# EAGLE design 2014-11-21_2.2_lcd_13 (EAGLE 7.1.0)
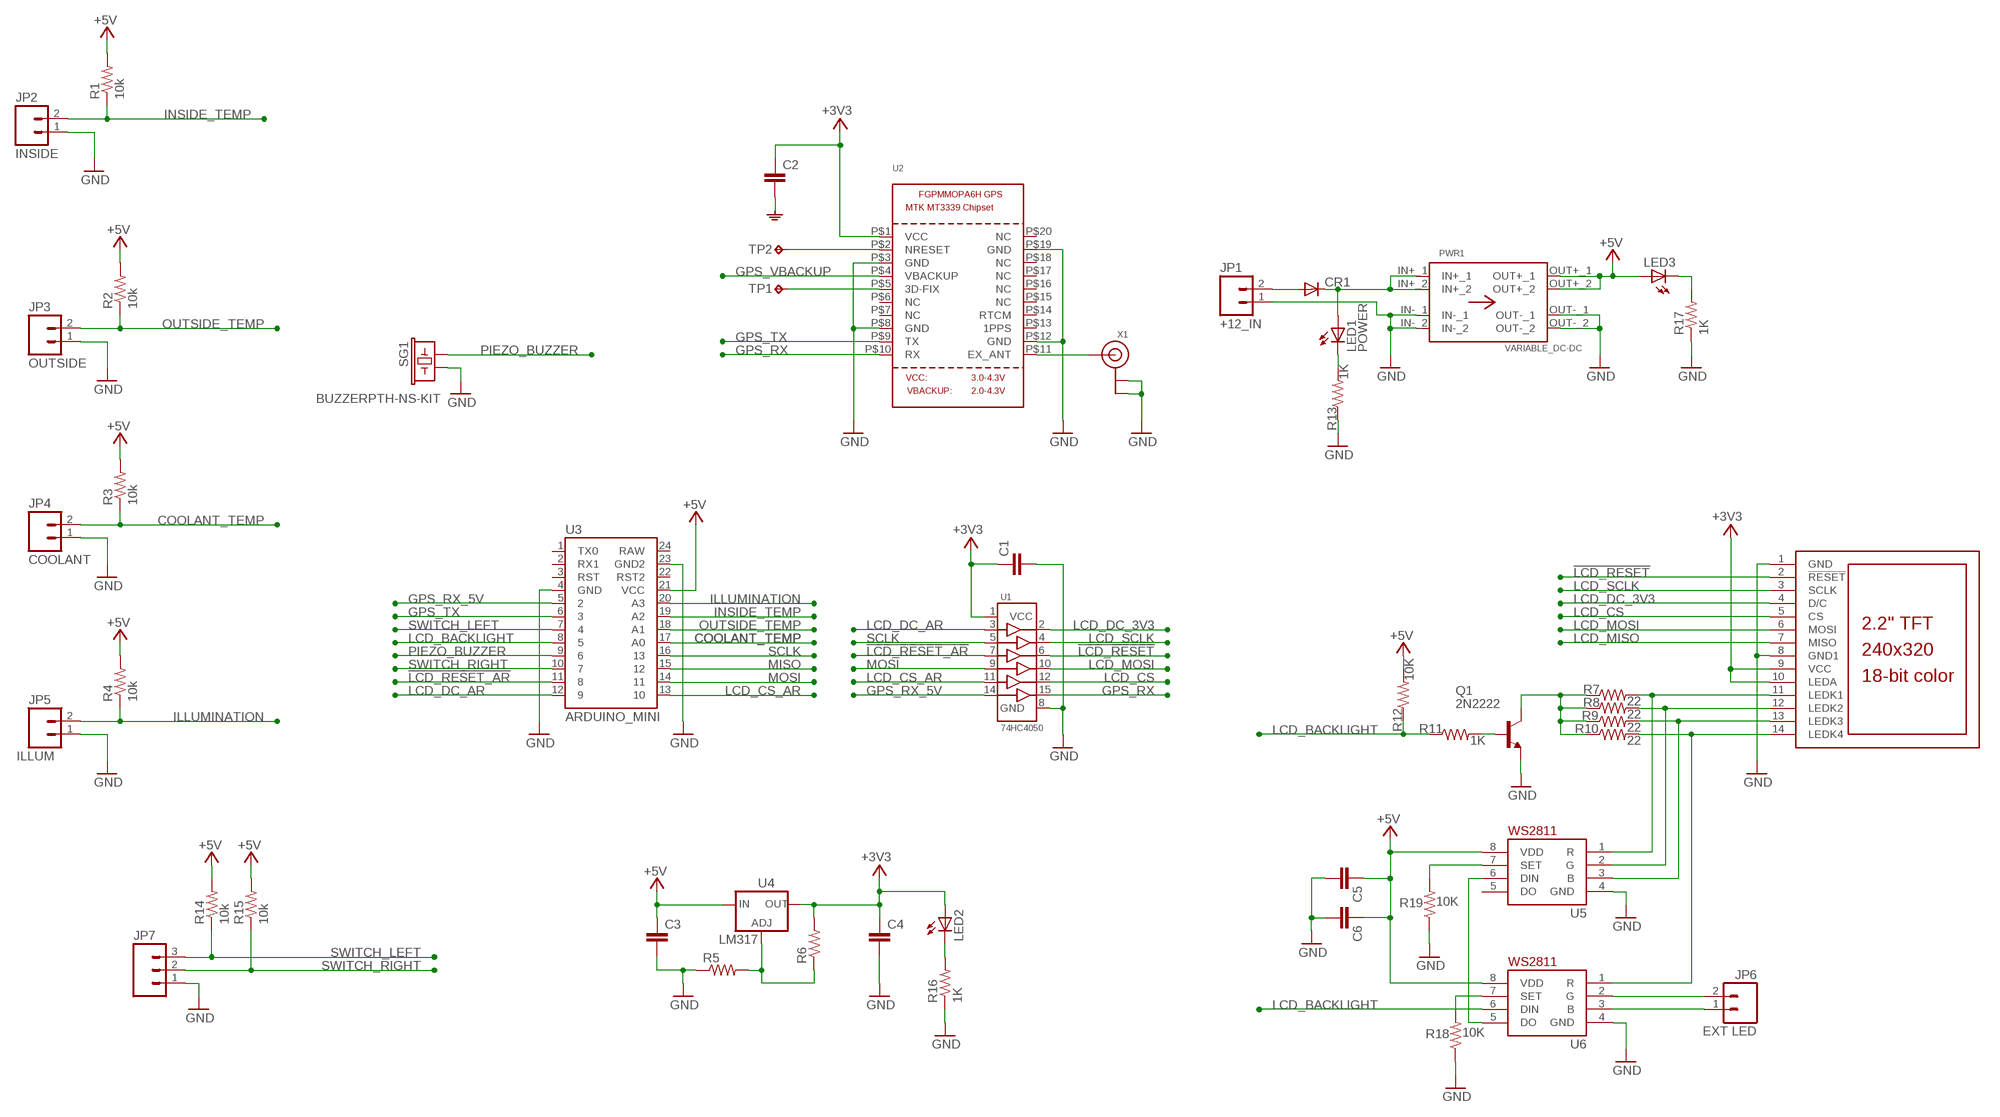
[diagram p0: schematic, sheet 1]

## Parts
C1  CAP0805  [0805]
C2  CAP0805  [0805]
C3  CAP0805  [0805]
C4  CAP0805  [0805]
C5  CAP0603-CAP  [0603-CAP]
C6  CAP0603-CAP  [0603-CAP]
CR1  DIODESMA-ALT  [SMA-DIODE_ALT]
JP1  +12_IN  M02JST-PTH-VERT  [JST-2-PTH-VERT]
JP2  INSIDE  M02JST-PTH-VERT  [JST-2-PTH-VERT]
JP3  OUTSIDE  M02JST-PTH-VERT  [JST-2-PTH-VERT]
JP4  COOLANT  M02JST-PTH-VERT  [JST-2-PTH-VERT]
JP5  ILLUM  M02JST-PTH-VERT  [JST-2-PTH-VERT]
JP6  EXT LED  M02JST-PTH-VERT  [JST-2-PTH-VERT]
JP7  M03POLAR  [MOLEX-1X3]
LED1  POWER  LED3MM  [LED3MM]
LED2  LED0603  [LED-0603]
LED3  LED0603  [LED-0603]
PWR1  VARIABLE_DC-DC  [VARIABLE_DC-DC]
Q1  2N2222  [TO92]
R1  10k  RESISTOR0805-RES  [0805]
R2  10k  RESISTOR0805-RES  [0805]
R3  10k  RESISTOR0805-RES  [0805]
R4  10k  RESISTOR0805-RES  [0805]
R5  RESISTOR0805-RES  [0805]
R6  RESISTOR0805-RES  [0805]
R7  22  RESISTOR0805-RES  [0805]
R8  22  RESISTOR0805-RES  [0805]
R9  22  RESISTOR0805-RES  [0805]
R10  22  RESISTOR0805-RES  [0805]
R11  1K  RESISTOR0805-RES  [0805]
R12  10K  RESISTOR0805-RES  [0805]
R13  1K  RESISTOR0805-RES  [0805]
R14  10k  RESISTOR0805-RES  [0805]
R15  10k  RESISTOR0805-RES  [0805]
R16  1K  RESISTOR0805-RES  [0805]
R17  1K  RESISTOR0805-RES  [0805]
R18  10K  RESISTOR0805-RES  [0805]
R19  10K  RESISTOR0805-RES  [0805]
SG1  BUZZERPTH-NS-KIT  [BUZZER-12MM-NS-KIT]
TP1  TPPAD1-13  [P1-13]
TP2  TPPAD1-13  [P1-13]
U1  74HC4050  [SO16]
U2  GPS_FGPMMOPA6H  [FGPMMOPA6H]
U3  ARDUINO_MINI  [ARDUINO_MINI]
U4  LM317  V_REG_317SMD  [SOT223]
U5  WS2811-SOP8  [SO08-SKINNYPADS]
U6  WS2811-SOP8  [SO08-SKINNYPADS]
U$1  2.2_LCD  [2.2_LCD]
X1  ANTENNA_U.FL  [U.FL]

## Nets
!LCD_RESET: U1.6 U$1.2(!RESET)
!LCD_RESET_AR: U1.7 U3.11
+3V3: C1.1 C2.1 C4.1 LED2.A R6.2 U1.1(VCC) U2.P$1(VCC) U4.2(OUT) U$1.9(VCC) U$1.10(LEDA)
+5V: C3.1 C5.1 C6.1 LED3.A PWR1.OUT+_1 PWR1.OUT+_2 R1.2 R2.2 R3.2 R4.2 R12.2 R14.2 R15.2 U3.21(VCC) U4.3(IN) U5.8(VDD) U6.8(VDD)
COOLANT_TEMP: JP4.2 R3.1 U3.17(A0)
GND: C1.2 C3.2 C4.2 C5.2 C6.2 JP1.1 JP2.1 JP3.1 JP4.1 JP5.1 JP7.1 PWR1.IN-_1 PWR1.IN-_2 PWR1.OUT-_1 PWR1.OUT-_2 Q1.1(E) R5.1 R13.1 R16.1 R17.1 R18.1 R19.1 SG1.- U1.8(GND) U2.P$3(GND) U2.P$8(GND) U2.P$12(GND) U2.P$19(GND) U3.4(GND) U3.23(GND2) U5.4(GND) U6.4(GND) U$1.1(GND) U$1.8(GND1) X1.1(GND) X1.2(GND)
GPS_RX: U1.15 U2.P$10(RX)
GPS_RX_5V: U1.14 U3.5
GPS_TX: U2.P$9(TX) U3.6
GPS_VBACKUP: U2.P$4(VBACKUP)
ILLUMINATION: JP5.2 R4.1 U3.20(A3)
INSIDE_TEMP: JP2.2 R1.1 U3.19(A2)
LCD_BACKLIGHT: R11.1 R12.1 U3.8 U6.6(DIN)
LCD_CS: U1.12 U$1.5(CS)
LCD_CS_AR: U1.11 U3.13
LCD_DC_3V3: U1.2 U$1.4(D/C)
LCD_DC_AR: U1.3 U3.12
LCD_MISO: U$1.7(MISO)
LCD_MOSI: U1.10 U$1.6(MOSI)
LCD_SCLK: U1.4 U$1.3(SCLK)
MISO: U3.15
MOSI: U1.9 U3.14
N$1: TP2.TP U2.P$2(NRESET)
N$2: U2.P$11(EX_ANT) X1.3(SIGNAL)
N$3: R7.2 U5.1(R) U$1.11(LEDK1)
N$4: R8.2 U5.2(G) U$1.12(LEDK2)
N$5: R9.2 U5.3(B) U$1.13(LEDK3)
N$6: R5.2 R6.1 U4.1(ADJ)
N$7: R10.2 U6.1(R) U$1.14(LEDK4)
N$8: Q1.3(C) R7.1 R8.1 R9.1 R10.1
N$9: Q1.2(B) R11.2
N$10: CR1.A JP1.2
N$11: CR1.C LED1.A PWR1.IN+_1 PWR1.IN+_2
N$13: JP6.2 U6.2(G)
N$17: LED1.K(C) R13.2
N$18: TP1.TP U2.P$5(3D-FIX)
N$19: LED2.C R16.2
N$20: LED3.C R17.2
N$21: U5.6(DIN) U6.5(DO)
N$22: R18.2 U6.7(SET)
N$23: JP6.1 U6.3(B)
N$24: R19.2 U5.7(SET)
OUTSIDE_TEMP: JP3.2 R2.1 U3.18(A1)
P$1: C2.2 ; supply symbol labelled GND
PIEZO_BUZZER: SG1.+ U3.9
SCLK: U1.5 U3.16
SWITCH_LEFT: JP7.3 R14.1 U3.7
SWITCH_RIGHT: JP7.2 R15.1 U3.10
Unconnected: U2.P$6(NC) U2.P$7(NC) U2.P$13(1PPS) U2.P$14(RTCM) U2.P$15(NC) U2.P$16(NC) U2.P$17(NC) U2.P$18(NC) U2.P$20(NC) U3.1(TX0) U3.2(RX1) U3.3(RST) U3.22(RST2) U3.24(RAW) U5.5(DO)

## Library data of the parts
C1-C6 = SparkFun-Passives:CAP: Capacitor Standard 0603 ceramic capacitor, and 0.1" leaded capacitor.
CR1 = SparkFun-DiscreteSemi:DIODE: Diode These are standard reverse protection diodes and small signal diodes. SMA package can handle up to about 1A. SOD-323 can handle about 200mA. What the SOD-323 package when ordering, there are some mfgs out there that are 5-pin packages.
JP1-JP6 = SparkFun-Connectors:M02: Standard 2-pin 0.1" header. Use with - straight break away headers ( PRT-00116) - right angle break away headers (PRT-00553) - swiss pins (PRT-00743) - machine pins (PRT-00117) - female headers (PRT-00115) Molex polarized connector foot print use with: PRT-08233 with associated crimp pins and housings. 2.54_SCREWTERM for use with PRT-10571. 3.5mm Screw Terminal footprints for PRT-08084 5mm Screw Terminal footprints for use with PRT-08432
JP7 = SparkFun-Connectors:M03: Header 3 Standard 3-pin 0.1" header. Use with straight break away headers (SKU : PRT-00116), right angle break away headers (PRT-00553), swiss pins (PRT-00743), machine pins (PRT-00117), and female headers (PRT-00115). Molex polarized connector foot print use with SKU : PRT-08232 with associated crimp pins and housings.
LED1-LED3 = SparkFun-LED:LED: LEDs Standard schematic elements and footprints for 5mm, 3mm, 1206, and 0603 sized LEDs. 5mm - Spark Fun Electronics SKU : COM-00529 (and others)
PWR1 = !EXTRON:VARIABLE_DC-DC
Q1 = adafruit:2N2222: NPN TRANSISTOR Big oval pads
R1-R19 = SparkFun-Passives:RESISTOR: Resistor Basic schematic elements and footprints for 0603, 1206, and PTH resistors.
SG1 = SparkFun-Electromechanical:BUZZER: Buzzer 12mm Spark Fun Electronics SKU : Comp-Buzzer
TP1 TP2 = testpad:TP: Test pad
U1 = !EXTRON:74HC4050
U2 = adafruit:GPS_FGPMMOPA6H: GPS Module - MTK MT3339 Chipset, -165dBm sensitivity, 22 channels, 10Hz, auto-select external antenna options
U3 = SparkFun-Boards:ARDUINO_MINI: Arduino Pro Mini footprint
U4 = SparkFun-PowerIC:V_REG_317: Voltage Regulator Standard LM317 adjustable voltage regulator. AOI (Adjust Output Input). Google 'LM317 Calculator' for easy to use app to get the two resistor values needed. 240/720 for 5V output. 240/390 for 3.3V output. Spark Fun Electronics SKU : COM-00527
U5 U6 = adafruit:WS2811
U$1 = !EXTRON:2.2_LCD
X1 = adafruit:ANTENNA_U.FL: U.FL Antenna Connector

## Board
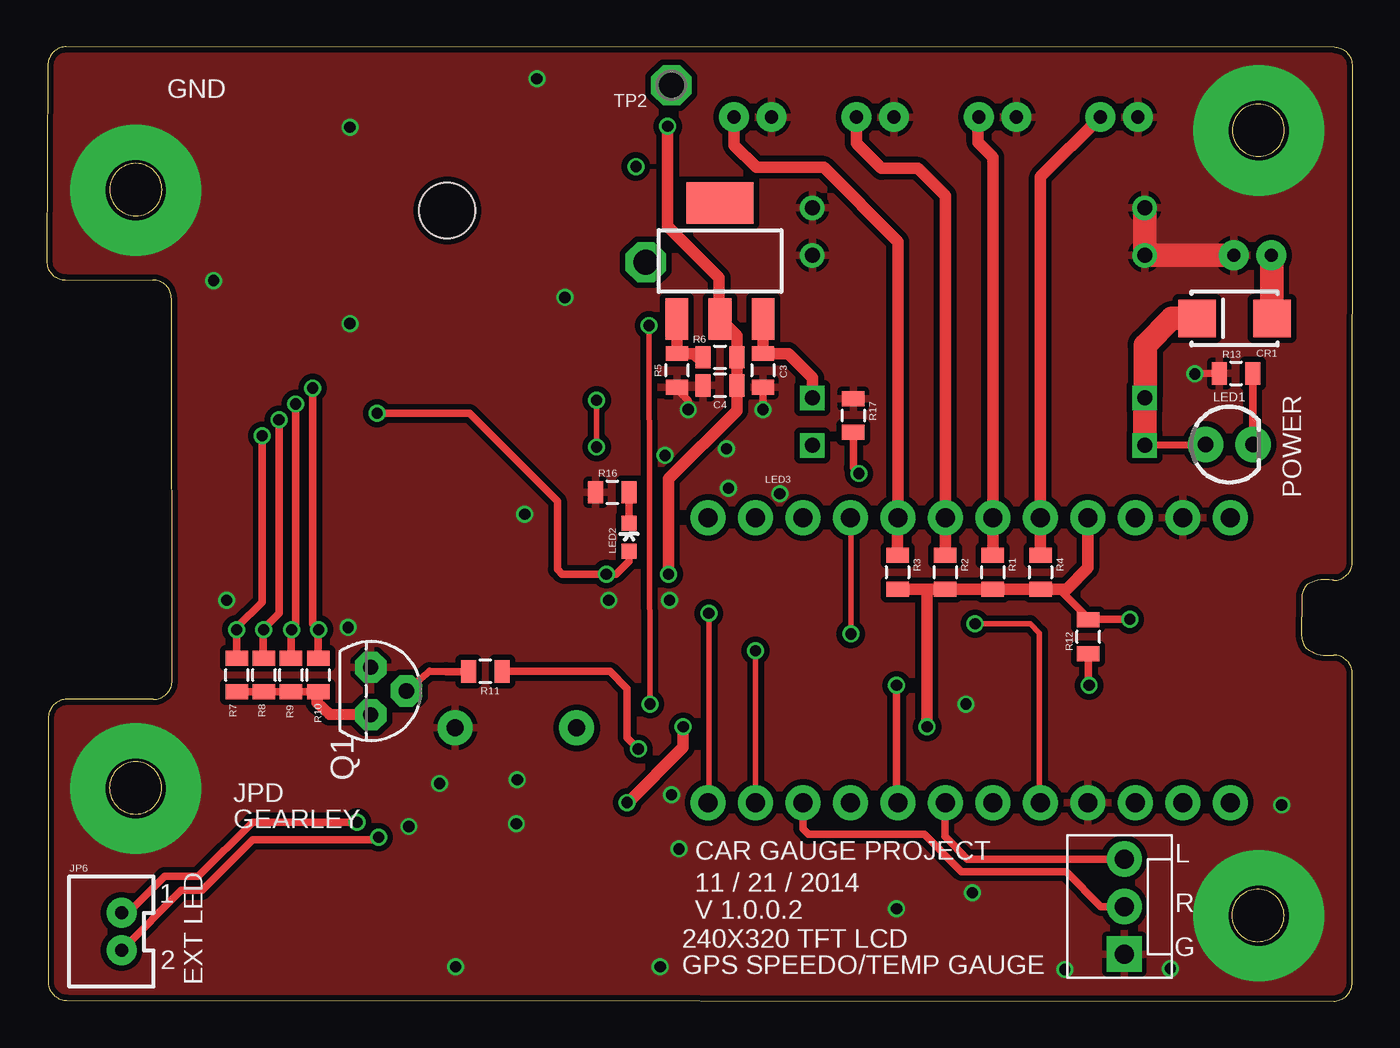
[diagram p1: board, top side]
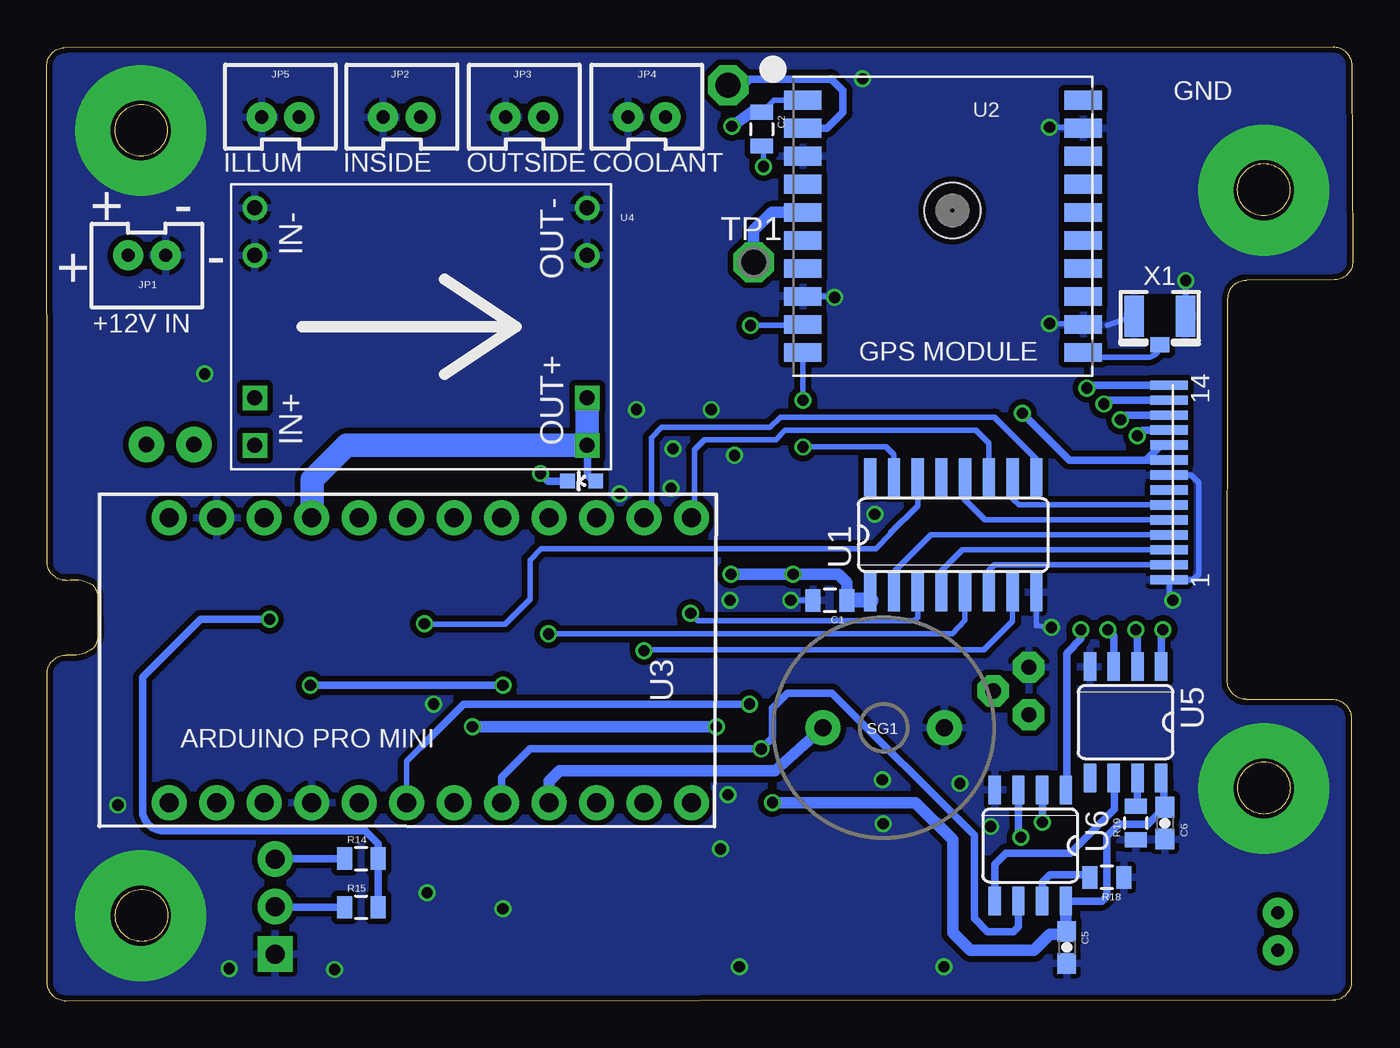
[diagram p2: board, bottom side, seen from below]

Size 69.89 x 51.05 mm. Coordinates in mm from the lower left corner, seen from the top.
Outline: 0.08,15.14 0.08,1.04 arc45 0.37,0.33 arc45 1.08,0.04 68.86,0 arc45 69.56,0.29 arc45 69.86,1 69.87,17.5 arc45 69.57,18.21 arc45 68.87,18.51 68.79,18.51 arc-45 67.44,18.85 arc-45 67.14,19.56 67.14,21.56 arc-45 67.44,22.26 arc-45 68.79,22.51 68.87,22.51 arc45 69.58,22.8 arc45 69.87,23.5 69.89,50.01 arc45 69.59,50.72 arc45 68.89,51.01 1.06,51.05 arc45 0.35,50.76 arc45 0.06,50.05 0,39.57 arc45 0.29,38.87 arc45 1,38.57 5.67,38.57 arc-45 6.38,38.28 arc-45 6.67,37.57 6.71,17.14 arc-45 6.42,16.43 arc-45 5.71,16.14 1.08,16.14 arc45 0.38,15.85 arc45 0.08,15.14
Outline: 6.17,43.41 arc180 3.37,43.41 arc180 6.17,43.41
Outline: 6.15,11.41 arc180 3.35,11.41 arc180 6.15,11.41
Outline: 66.21,4.58 arc180 63.41,4.58 arc180 66.21,4.58
Outline: 66.23,46.58 arc180 63.43,46.58 arc180 66.23,46.58
Copper layers (1*16): Top 0.035mm / dielectric 1.5mm / Bottom 0.035mm
Design rules "dirt_cheap_dirty_boards.v1": minimum track width 5mil, minimum drill 12mil, track to track 5mil, track to pad 5mil, pad to pad 5mil, via to via 5mil, smd to smd 0mil, copper to edge 10mil, drill to drill 10mil, minimum pad ring 10mil, minimum via ring 6mil, stop-mask expansion 2mil, vias tented up to drill 25mil, thermal gap 10mil

### Footprints (pad centres in the part's own frame; a part is rotated, then mirrored left to right if it is on the bottom)
0805 = smd 0.8 x 1.2: 1 -0.9,0; 2 0.9,0
0603-CAP = smd 1.1 x 1: 1 -0.85,0; 2 0.85,0
SMA-DIODE_ALT = smd 2 x 2: A -2,0; C 2,0
JST-2-PTH-VERT = drill 0.7 pad 1.6: 1 -1,-0.55; 2 1,-0.55
MOLEX-1X3 = drill 1.016 pad 1.88 square: 1 0,0 | drill 1.016 pad 1.88: 2 2.54,0; 3 5.08,0
LED3MM = drill 0.813 pad 1.88: A -1.27,0; K 1.27,0
LED-0603 = smd 0.8 x 0.8: A 0,-0.75; C 0,0.75
VARIABLE_DC-DC = drill 0.8 square: IN+_1 -10.16,7.62; IN+_2 -7.62,7.62; OUT+_1 -10.16,-10.16; OUT+_2 -7.62,-10.16 | drill 0.8: IN-_1 0,7.62; IN-_2 2.54,7.62; OUT-_1 0,-10.16; OUT-_2 2.54,-10.16
TO92 = drill 0.813 pad 1.676 octagon: 1 -1.27,0; 2 0,1.905; 3 1.27,0
BUZZER-12MM-NS-KIT = drill 0.9 pad 1.88: + 3.25,0; - -3.25,0
P1-13 = drill 1.321 pad 2.159 octagon: TP 0,0
SO16 = smd 0.66 x 2.032: 1 -4.445,-3.073; 2 -3.175,-3.073; 3 -1.905,-3.073; 4 -0.635,-3.073; 5 0.635,-3.073; 6 1.905,-3.073; 7 3.175,-3.073; 8 4.445,-3.073; 9 4.445,3.073; 10 3.175,3.073; 11 1.905,3.073; 12 0.635,3.073; 13 -0.635,3.073; 14 -1.905,3.073; 15 -3.175,3.073; 16 -4.445,3.073
FGPMMOPA6H = smd 2 x 1: P$1 -7.5,6.75; P$2 -7.5,5.25; P$3 -7.5,3.75; P$4 -7.5,2.25; P$5 -7.5,0.75; P$6 -7.5,-0.75; P$7 -7.5,-2.25; P$8 -7.5,-3.75; P$9 -7.5,-5.25; P$10 -7.5,-6.75; P$11 7.5,-6.75; P$12 7.5,-5.25; P$13 7.5,-3.75; P$14 7.5,-2.25; P$15 7.5,-0.75; P$16 7.5,0.75; P$17 7.5,2.25; P$18 7.5,3.75; P$19 7.5,5.25; P$20 7.5,6.75 | hole 3: 0.5,0.85
ARDUINO_MINI = drill 1.016 pad 1.88: 1 -7.62,12.7; 2 -7.62,10.16; 3 -7.62,7.62; 4 -7.62,5.08; 5 -7.62,2.54; 6 -7.62,0; 7 -7.62,-2.54; 8 -7.62,-5.08; 9 -7.62,-7.62; 10 -7.62,-10.16; 11 -7.62,-12.7; 12 -7.62,-15.24; 13 7.62,-15.24; 14 7.62,-12.7; 15 7.62,-10.16; 16 7.62,-7.62; 17 7.62,-5.08; 18 7.62,-2.54; 19 7.62,0; 20 7.62,2.54; 21 7.62,5.08; 22 7.62,7.62; 23 7.62,10.16; 24 7.62,12.7
SOT223 = smd 1.219 x 2.235: 1 -2.311,-3.099; 2 0,-3.099; 3 2.311,-3.099 | smd 3.6 x 2.2: 4 0,3.099
SO08-SKINNYPADS = smd 0.66 x 1.524: 1 -1.905,-2.973; 2 -0.635,-2.973; 3 0.635,-2.973; 4 1.905,-2.973; 5 1.905,2.973; 6 0.635,2.973; 7 -0.635,2.973; 8 -1.905,2.973
2.2_LCD = smd 0.5 x 2: 1 5.2,-0.4; 2 4.4,-0.4; 3 3.6,-0.4; 4 2.8,-0.4; 5 2,-0.4; 6 1.2,-0.4; 7 0.4,-0.4; 8 -0.4,-0.4; 9 -1.2,-0.4; 10 -2,-0.4; 11 -2.8,-0.4; 12 -3.6,-0.4; 13 -4.4,-0.4; 14 -5.2,-0.4
U.FL = smd 2.2 x 1.05: 1 0,1.375; 2 0,-1.375 | smd 0.8 x 1: 3 1.525,0

### Placement (x,y rotation side)
C1  27.98,21.44 180 bottom
C2  31.63,46.64 270 bottom
C3  38.33,33.74 270 top
C4  36.03,32.94 180 top
C5  15.31,2.87 270 bottom
C6  10.06,9.52 270 bottom
CR1  63.56,36.52 180 top
JP1  64.53,39.34 180 bottom
JP2  50.88,47.84 0 bottom
JP3  44.33,47.84 0 bottom
JP4  37.78,47.84 0 bottom
JP5  57.38,47.84 0 bottom
JP6  3.46,3.72 90 top
JP7  57.66,2.52 90 top
LED1  63.28,29.77 0 top
LED2  31.16,24.82 0 top
LED3  41.26,27.82 90 bottom
PWR1  51.13,39.89 90 bottom
Q1  17.34,16.59 270 top
R1  50.63,22.94 270 top
R2  48.08,22.94 270 top
R3  45.53,22.94 270 top
R4  53.18,22.94 270 top
R5  33.73,33.74 90 top
R6  36.03,34.44 0 top
R7  10.18,17.44 90 top
R8  11.63,17.44 90 top
R9  13.08,17.44 90 top
R10  14.53,17.44 90 top
R11  23.48,17.64 180 top
R12  55.73,19.49 90 top
R13  63.65,33.58 0 top
R14  53.06,7.62 0 bottom
R15  53.06,5.02 0 bottom
R16  30.26,27.22 0 top
R17  43.16,31.32 270 top
R18  13.16,6.62 180 bottom
R19  11.61,9.52 90 bottom
SG1  25.11,14.62 180 bottom
TP1  32.06,39.52 0 bottom
TP2  33.43,48.99 180 top
U1  21.38,24.94 0 bottom
U2  21.93,41.44 0 bottom
U3  50.63,18.24 90 bottom
U4  36.03,39.59 0 top
U5  12.16,14.92 180 bottom
U6  17.26,8.32 180 bottom
U$1  9.43,27.74 270 bottom
X1  10.33,36.64 270 bottom

### Tracks (layer width: path | path; a pad name or v marks a point on that pad's centre or on a via)
!LCD_RESET
  Bottom 0.305: U$1.2 19.18,23.34 19.48,23.04 U1.6
!LCD_RESET_AR  (via drill 0.6)
  Top 0.305: v37.93,18.74 U3.11
  Bottom 0.305: U1.7 18.2,20.31 19.73,18.79 37.88,18.79 v37.93,18.74
+3V3  (via drill 0.6)
  Top 0.406: v17.68,31.44 22.63,31.44 27.33,26.74 27.33,23.09 27.58,22.84 v29.95,22.84 30.46,22.84 31.16,23.54 LED2.A
  Top 0.61: v33.23,46.79 33.23,41.44 35.98,38.69 35.98,36.54 U4.2 36.93,35.59 R6.2 C4.1 36.93,31.59 33.28,27.94 v33.28,22.84
  Bottom 0.305: U2.P$1 30.98,48.19 C2.1 | U1.1 25.82,21.48 25.78,21.44
  Bottom 0.406: U$1.9 11.08,28.94 | U$1.10 10.28,29.74 11.08,28.94 | 11.08,28.94 15.18,28.94 v17.68,31.44
  Bottom 0.61: C2.1 32.18,47.54 v33.23,46.79 | C1.1 27.08,22.39 27.53,22.84 v29.95,22.84 v33.28,22.84
  Bottom 0.813: 25.78,21.44 C1.1
+5V  (via drill 0.6)
  Top 0.406: 54.18,22.04 55.73,20.49 R12.2 55.76,20.42 v57.96,20.42 | v31.06,10.62 31.11,10.62 | 47.11,21.94 47.01,22.04
  Top 0.61: R3.2 47.01,22.04 R2.2 R1.2 R4.2 54.18,22.04 54.58,22.04 55.71,23.17 U3.21 | U4.3 C3.1 39.68,34.64 40.98,33.34 PWR1.OUT+_2 | 31.11,10.62 34.06,13.57 v34.06,14.67 | v47.11,14.67 47.11,21.94
  Bottom 0.406: v57.96,20.42 61.66,20.42 64.76,17.32 64.76,10.22 arc-90 63.66,9.12 52.86,9.12 52.16,8.42 R14.2 R15.2 | LED3.A 40.66,27.82 40.96,28.12 PWR1.OUT+_1 | U5.8 10.11,11.8 10.11,10.42 | 10.11,10.42 C6.1 | 15.36,3.67 C5.1 15.35,3.76 | 10.11,10.42 10.11,10.32 10.96,9.47 12.51,9.47 13.16,8.82 13.16,5.62 13.43,5.35 U6.8
  Bottom 0.61: v34.06,14.67 v47.11,14.67 | U6.8 15.35,3.76 | v31.06,10.62 23.41,10.62 21.41,8.62 21.41,3.67 20.46,2.72 17.06,2.72 16.21,3.57 15.46,3.57 C5.1
  Bottom 1.27: U3.21 55.68,25.89 55.68,27.89 53.84,29.73 PWR1.OUT+_1 PWR1.OUT+_2
COOLANT_TEMP
  Top 0.61: R3.1 45.53,25.84 U3.17 45.55,40.62 41.58,44.59 37.98,44.59 36.78,45.79 JP4.2
GND  (via drill 0.6, 3.2 pad 7)
  Top 0.406: R5.1 33.73,32.74 34.33,32.14 v34.33,31.64 | C3.2 v38.33,31.64 | R13.1 v61.43,33.55
  Top 1.27: PWR1.IN-_2 PWR1.IN-_1 JP1.1
  Bottom 0.305: U$1.8 8.63,28.14 8.23,27.74 8.23,22.84 8.53,22.54 U$1.1 9.83,21.64 v9.63,21.44 | C1.2 v30.08,21.44 | U1.8 16.93,20.08 v16.13,19.99 | X1.2 13.13,36.14 | X1.1 8.93,37.24 v8.93,38.54 | U2.P$12 15.23,36.24 v16.23,36.24 | U2.P$19 15.13,46.74 v16.23,46.74 | U2.P$8 27.88,37.69 v27.73,37.64
  Bottom 0.406: v61.43,33.55 61.56,33.55
  other vias: 25.58,26.04 33.08,29.19 36.38,29.54 36.48,27.44 33.33,21.44 49.18,15.89 33.43,11.04 26.23,49.34 39.23,27.14 66.08,10.49 25.18,11.84 21.03,11.64 25.13,9.49 19.38,9.34 21.88,1.84 33.83,8.14 60.13,1.74 54.48,1.69 45.48,4.94 49.53,5.79 32.83,1.84 4.76,43.37 4.76,11.37 64.86,46.57 64.86,4.57
  pour Bottom (isolate 0.305): 0.23,50.89 69.78,50.84 69.68,0.14 34.88,0.49 0.11,0.11
  pour Top (isolate 0.305): 0.13,0.14 0.23,50.89 69.78,50.84 69.68,0.14
GPS_RX  (via drill 0.6)
  Top 0.305: v29.43,29.64 v29.43,32.14
  Bottom 0.305: U1.15 24.55,29.21 24.98,29.64 v29.43,29.64 | v29.43,32.14 U2.P$10
GPS_RX_5V  (via drill 0.6)
  Top 0.305: v49.68,20.19 52.63,20.19 53.13,19.69 53.13,10.66
  Top 0.406: 53.13,10.66 U3.5
  Bottom 0.305: U1.14 23.28,26.48 24.73,25.04 24.73,24.99 25.53,24.19 43.43,24.19 44.03,23.59 44.03,21.5 45.36,20.17 49.66,20.17 v49.68,20.19 | 53.13,10.66 U3.5
GPS_TX  (via drill 0.6)
  Top 0.305: v32.28,15.89 v32.23,36.14
  Bottom 0.305: U3.6 50.63,12.84 49.83,13.64 | v32.23,36.14 29.48,36.14 U2.P$9
  Bottom 0.406: v32.28,15.89 47.58,15.89 49.83,13.64
ILLUMINATION
  Top 0.61: U3.20 R4.1 53.18,44.09 JP5.2
INSIDE_TEMP
  Top 0.61: R1.1 U3.19 50.63,45.14 49.83,45.94 49.83,47.24 JP2.2
LCD_BACKLIGHT  (via drill 0.6)
  Top 0.406: R12.1 55.73,16.94 v55.78,16.89 | v45.48,16.89 45.48,10.69 U3.8 | R11.1 30.14,17.64 31.06,16.72 31.06,14.09 v31.66,13.49
  Bottom 0.406: U3.8 45.55,11.97 44.03,13.49 v31.66,13.49 31.06,14.09 31.06,15.67 30.26,16.47 27.86,16.47 20.26,8.87 20.26,4.42 19.56,3.72 18.16,3.72 17.89,3.98 U6.6 | v55.78,16.89 v45.48,16.89
LCD_CS
  Bottom 0.305: U$1.5 19.68,25.74 20.78,26.84 20.78,27.98 U1.12
LCD_CS_AR
  Bottom 0.305: U1.11 19.47,29.83 20.18,30.54 30.38,30.54 30.88,30.04 34.68,30.04 35.23,29.49 35.23,26.02 U3.13
LCD_DC_3V3
  Bottom 0.305: U$1.4 22.58,24.94 24.48,23.04 24.48,21.94 U1.2
LCD_DC_AR  (via drill 0.6)
  Top 0.305: v35.43,20.74 35.43,10.66 U3.12
  Bottom 0.305: U1.3 23.28,20.54 23.48,20.34 35.03,20.34 v35.43,20.74
LCD_MOSI
  Bottom 0.305: U$1.6 17.88,26.54 18.18,26.84 18.18,27.99 U1.10
LCD_SCLK
  Bottom 0.305: U$1.3 20.88,24.14 21.98,23.04 21.98,21.9 U1.4
MOSI
  Bottom 0.305: U1.9 16.93,28.99 19.18,31.24 30.63,31.24 31.18,30.69 36.98,30.69 37.53,30.14 37.53,26.26 U3.14
N$1
  Bottom 0.406: U2.P$2 28.13,46.69 27.28,47.54 27.28,48.69 27.93,49.34 27.96,49.32 32.26,49.32 32.59,48.99 TP2.TP
N$2
  Bottom 0.305: X1.3 arc90 11,34.44 13.63,34.44 arc-90 13.88,34.69 U2.P$11
N$3  (via drill 0.6, 0.6 pad 0.3)
  Top 0.406: v11.53,30.24 11.53,21.34 10.18,19.99 10.18,19.94 | 10.18,19.94 R7.2 | 10.18,19.94 v10.16,19.87
  Bottom 0.406: U$1.11 11.23,30.54 v11.53,30.24 | U5.1 10.25,19.82 v10.16,19.87
N$4  (via drill 0.6)
  Top 0.406: v12.43,31.09 12.43,20.74 11.58,19.89 11.58,19.27 | 11.58,19.27 11.58,18.39 R8.2 | v11.61,19.87 11.58,19.27
  Bottom 0.406: U$1.12 12.18,31.34 v12.43,31.09 | U5.2 11.52,19.78 v11.61,19.87
N$5  (via drill 0.6)
  Top 0.406: 13.08,19.47 13.08,19.94 13.33,20.19 v13.33,31.94 | 13.08,19.47 R9.2 | v13.11,19.87 13.08,19.47
  Bottom 0.406: U$1.13 13.13,32.14 v13.33,31.94 | U5.3 12.79,19.55 v13.11,19.87
N$6
  Top 0.61: U4.1 33.72,35.75 33.73,35.74 R5.2 34.63,34.64 34.83,34.44 R6.1
N$7  (via drill 0.6)
  Top 0.406: v14.23,32.79 14.23,20.19 14.53,19.89 14.53,19.62 | 14.53,19.62 R10.2 | v14.56,19.87 14.48,19.57 14.53,19.62
  Bottom 0.406: U$1.14 14.08,32.94 v14.23,32.79 | v14.56,19.87 14.56,19.37 15.31,18.62 15.31,11.34 U6.1
N$8
  Top 0.406: R7.1 R8.1 R9.1 R10.1 14.61,16.46
  Top 0.61: Q1.3 15.13,15.35 14.46,15.97 14.46,16.47 R10.1
N$9
  Top 0.406: Q1.2 20.48,17.64 21.36,17.62 22.56,17.62 R11.2
N$10
  Top 1.27: CR1.A 65.56,39.86 JP1.2
N$11
  Top 0.406: PWR1.IN+_1 LED1.A
  Top 1.27: PWR1.IN+_1 PWR1.IN+_2 58.78,32.3 58.78,35.09 60.21,36.52 CR1.C
N$13  (via drill 0.6)
  Top 0.406: JP6.2 4.36,4.72 6.31,6.67 8.11,6.67 11.01,9.57 v16.61,9.57
  Bottom 0.406: U6.2 16.62,9.58 v16.61,9.57
N$17
  Top 0.406: LED1.K R13.2
N$18
  Bottom 0.61: U2.P$5 31.09,42.19 32.06,41.22 TP1.TP
N$19
  Top 0.406: R16.2 LED2.C
N$20  (via drill 0.6)
  Top 0.406: R17.2 43.16,28.52 v43.46,28.22
  Bottom 0.406: LED3.C 43.06,27.82 v43.46,28.22
N$21
  Bottom 0.406: U6.5 19.16,7.31 18.56,7.92 15.11,7.92 12.76,10.27 12.76,11.91 U5.6
N$22
  Bottom 0.406: U6.7 16.61,5.36 16.61,6.37 16.21,6.77 14.21,6.77 R18.2
N$23  (via drill 0.6)
  Top 0.406: JP6.1 7.21,5.92 8.31,5.92 11.01,8.62 17.61,8.62 v17.76,8.77
  Bottom 0.406: U6.3 17.89,8.9 v17.76,8.77
N$24
  Bottom 0.406: U5.7 11.52,10.5 R19.2
OUTSIDE_TEMP
  Top 0.61: R2.1 U3.18 48.09,43.08 46.63,44.54 44.68,44.54 43.33,45.89 JP3.2
P$1  (via drill 0.6)
  Bottom 0.305: C2.2 31.52,45.72 31.53,45.07 v31.53,44.64
PIEZO_BUZZER
  Bottom 0.61: U3.9 43.01,11.77 42.46,12.32 30.91,12.32 SG1.+
SCLK  (via drill 0.6)
  Top 0.305: U3.16 43.03,25.84 v43.03,19.64
  Bottom 0.305: v43.03,19.64 21.43,19.64 20.74,20.37 U1.5
SWITCH_LEFT
  Top 0.406: JP7.3 49.28,7.6 48.06,8.82 48.06,10.59 U3.7
  Bottom 0.406: R14.1 57.64,7.62 JP7.3
SWITCH_RIGHT
  Top 0.406: JP7.2 56.42,5.06 54.56,6.92 48.96,6.92 46.96,8.92 40.76,8.92 40.46,9.22 U3.10
  Bottom 0.406: R15.1 57.62,5.02 JP7.2

### Text on the board
tNames: GND | POWER | JPD | GEARLEY | CAR GAUGE PROJECT | L | 11 / 21 / 2014 | 1 | R | V 1.0.0.2 | 240X320 TFT LCD | 2 | G | GPS SPEEDO/TEMP GAUGE
bNames: GND | COOLANT | OUTSIDE | INSIDE | ILLUM | - | + | - | + | +12V IN | GPS MODULE | ARDUINO PRO MINI